# Altium schematic sheet MPU.SchDoc
size A4
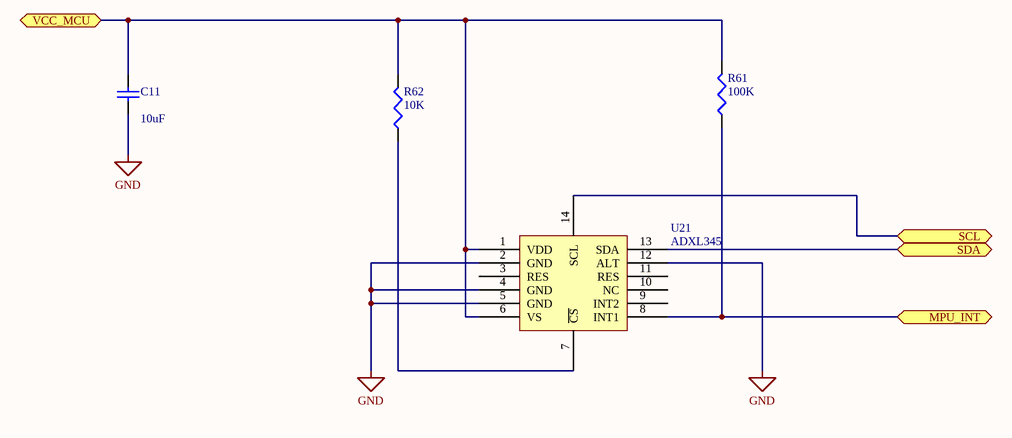
[diagram p0: MPU.SchDoc]

## Parts
C11  value 10uF  [0603]  (hidden comment: Cap Semi)
R61  value 100K  [0603]  (hidden comment: Res3)
R62  value 10K  [0603]  (hidden comment: Res3)
U21  ADXL345  [ALX]

## Ports
MPU_INT (bidir), SCL (bidir), SDA (bidir), VCC_MCU (bidir)

## Nets
GND: C11.1 U21.2(GND) U21.4(GND) U21.5(GND) U21.12(ALT)
MPU_INT: R61.1 U21.8(INT1) ; port MPU_INT
SCL: U21.14(SCL) ; port SCL
SDA: U21.13(SDA) ; port SDA
VCC_MCU: C11.2 R61.2 R62.2 U21.1(VDD) U21.6(VS) ; port VCC_MCU
NetR62_1: R62.1 U21.7(~{CS})

Not connected (* = marked no-connect by the designer): U21 3(RES) 9(INT2) 10(NC) 11(RES)

## Library data of the parts
C11 = Cap Semi: Capacitor (Semiconductor SIM Model); Published: 8-Jun-2000; LatestRevisionDate: 29-May-2009; LatestRevisionNote: IPC-7351 Footprint Added.; PackageReference: C1206; Publisher: Altium Limited; PackageDescription: Chip Capacitor
R61 R62 = Res3: Resistor; Published: 8-Jun-2000; LatestRevisionDate: 29-May-2009; LatestRevisionNote: IPC-7351 Footprint Added.; PackageReference: J1-0603; Publisher: Altium Limited; PackageDescription: Chip Resistor